# Altium schematic sheet Main.SchDoc: Main
size A4; Date: *******; ApprovedBy: *******; CheckedBy: None; Author: *******; CompanyName: *******; DrawnBy: H.Buter; Engineer: *******; Organization: *******; Address1: *******; Address2: *******; Address3: *******; Address4: *******; DocumentNumber: 01; Revision: *******; SheetNumber: 1; SheetTotal: 2; CurrentTime: *******; CurrentDate: *******; Time: *******; DocumentFullPathAndName: *******; DocumentName: *******; ModifiedDate: *******; ImagePath: *******; ProjectName: *******; Application_BuildNumber: *******
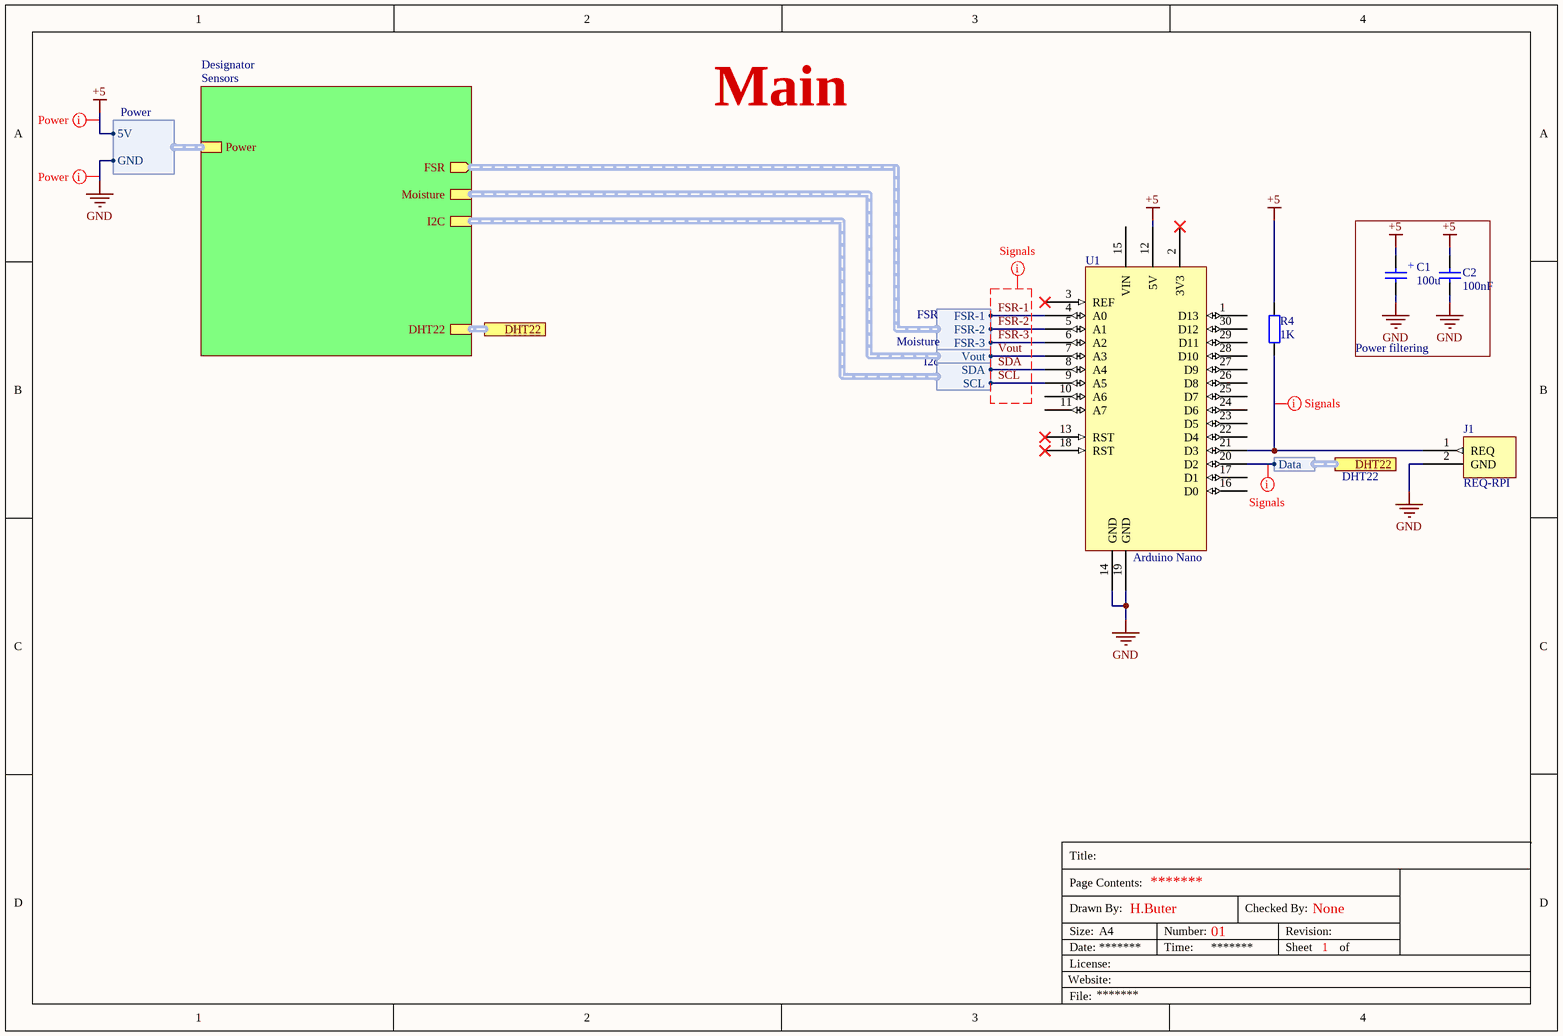
[diagram p0: Main.SchDoc]

## Parts
C1  100u  [Cap 100uF 16V 5x12mm]
C2  100nF  [C1206]
J1  REQ-RPI  [JST-XH 2pin]
R4  1K  [R1206]
U1  Arduino Nano  [Arduino Nano]

## Blocks framed on the sheet
Power filtering: C1 C2

## Sub-sheets
Designator = Sensors: FSR (out, harness FSR), Power (harness Power), I2C (harness I2c), Moisture (harness Moisture), DHT22 (harness DHT22)

## Ports
DHT22 (harness DHT22)

## Harnesses
FSR: FSR-1, FSR-2, FSR-3
Power: 5V, GND
I2c: SCL, SDA
Moisture: Vout
DHT22: Data

## Nets
+5: C1.1 C2.2 R4.2 U1.12(5V) ; sheet Designator/Power.5V
GND: C1.2 C2.1 J1.2(GND) U1.14(GND) U1.19(GND) ; sheet Designator/Power.GND
FSR-1: U1.4(A0) ; sheet Designator/FSR.FSR-1
FSR-2: U1.5(A1) ; sheet Designator/FSR.FSR-2
FSR-3: U1.6(A2) ; sheet Designator/FSR.FSR-3
SCL: U1.9(A5) ; sheet Designator/I2C.SCL
SDA: U1.8(A4) ; sheet Designator/I2C.SDA
Vout: U1.7(A3) ; sheet Designator/Moisture.Vout
NetJ1_1: J1.1(REQ) R4.1 U1.21(D3)
NetU1_20: U1.20(D2) ; port DHT22.Data

Not connected (* = marked no-connect by the designer): U1 1(D13) 2(3V3)* 3(REF)* 10(A6) 11(A7) 13(RST)* 15(VIN) 16(D0) 17(D1) 18(RST)* 22(D4) 23(D5) 24(D6) 25(D7) 26(D8) 27(D9) 28(D10) 29(D11) 30(D12)

## Buses and harness runs
harness port DHT22 = sheet Designator/DHT22

## Layout directives
net class Power: +5, GND
net class Signals: FSR-1, FSR-2, FSR-3, NetJ1_1, NetU1_20, SCL, SDA, Vout

## Notes on the sheet
- (near C1) Place @{"Id":"XWYLUBRW\MARYOLLX","ObjectType":2} and @{"Id":"XWYLUBRW\RRCBYOYS","ObjectType":2} as close as possible to the power pins of @{"Id":"XWYLUBRW\YIIVKUMM","ObjectType":2}
- Title:
- Drawn By:
- Page Contents:
- Checked By:
- Website:
- Size:
- Date:
- File:
- License:
- A4
- Number:
- Time:
- Revision:
- Sheet
- of
- (in symbol Cap 100uF 16V 5x12mm) +

## Library data of the parts
C1 = Cap 100uF 16V 5x12mm: value: 100u
C2 = Capacitor_1206: SMD Capacitor 1206; Published: 03-11-2016; LatestRevisionDate: 03-11-2016; LatestRevisionNote: Creation; PackageReference: C1206; Publisher: Windesheim; PackageDescription: Chip Capacitor, Body 3.2x1.6mm, Height 1.7mm, IPC Medium Density; Value: 100nF
J1 = REQ-RPI: Request connection to Raspberry Pi
R4 = Resistor_1206: SMD Resistor 1206; Published: 03-11-2016; LatestRevisionDate: 03-11-2016; LatestRevisionNote: Creation; PackageReference: R1206; Publisher: Windesheim; PackageDescription: Chip Resistor, Body 3.2x1.6mm, IPC Medium Density; Value: 1K